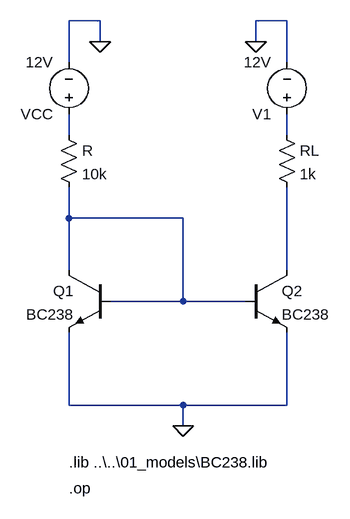
[diagram p0: schematic cursources_02_07_01_03_dc_op.asc]
cursources_02_07_01_03_dc_op.asc, the LTspice schematic file:
Version 4
SHEET 1 880 680
WIRE 96 -272 48 -272
WIRE 384 -272 336 -272
WIRE 96 -240 96 -272
WIRE 336 -240 336 -272
WIRE 48 -208 48 -272
WIRE 384 -208 384 -272
WIRE 48 -96 48 -128
WIRE 384 -96 384 -128
WIRE 48 32 48 -16
WIRE 224 32 48 32
WIRE 48 112 48 32
WIRE 384 112 384 -16
WIRE 224 160 224 32
WIRE 224 160 112 160
WIRE 320 160 224 160
WIRE 48 320 48 208
WIRE 224 320 48 320
WIRE 384 320 384 208
WIRE 384 320 224 320
WIRE 224 352 224 320
FLAG 224 352 0
FLAG 96 -240 0
FLAG 336 -240 0
SYMBOL npn 112 112 M0
SYMATTR InstName Q1
SYMATTR Value BC238
SYMBOL npn 320 112 R0
SYMATTR InstName Q2
SYMATTR Value BC238
SYMBOL res 32 -112 R0
SYMATTR InstName R
SYMATTR Value 10k
SYMBOL res 368 -112 R0
SYMATTR InstName RL
SYMATTR Value 1k
SYMBOL voltage 384 -112 R180
WINDOW 123 0 0 Left 2
WINDOW 39 0 0 Left 2
SYMATTR InstName V1
SYMATTR Value 12V
SYMBOL voltage 48 -112 R180
WINDOW 123 0 0 Left 2
WINDOW 39 0 0 Left 2
SYMATTR InstName VCC
SYMATTR Value 12V
TEXT 48 408 Left 2 !.lib ..\\..\\01_models\\BC238.lib
TEXT 48 448 Left 2 !.op

The netlist it stands for:
* cursources_02_07_01_03_dc_op.asc
Q1 N003 N003 0 0 BC238
Q2 N004 N003 0 0 BC238
R N001 N003 10k
RL N002 N004 1k
V1 N002 0 12V
VCC N001 0 12V
.model NPN NPN
.model PNP PNP
.lib standard.bjt
.lib ..\..\01_models\BC238.lib
.op
.backanno
.end